# EAGLE design Power Board (EAGLE 9.1.3)
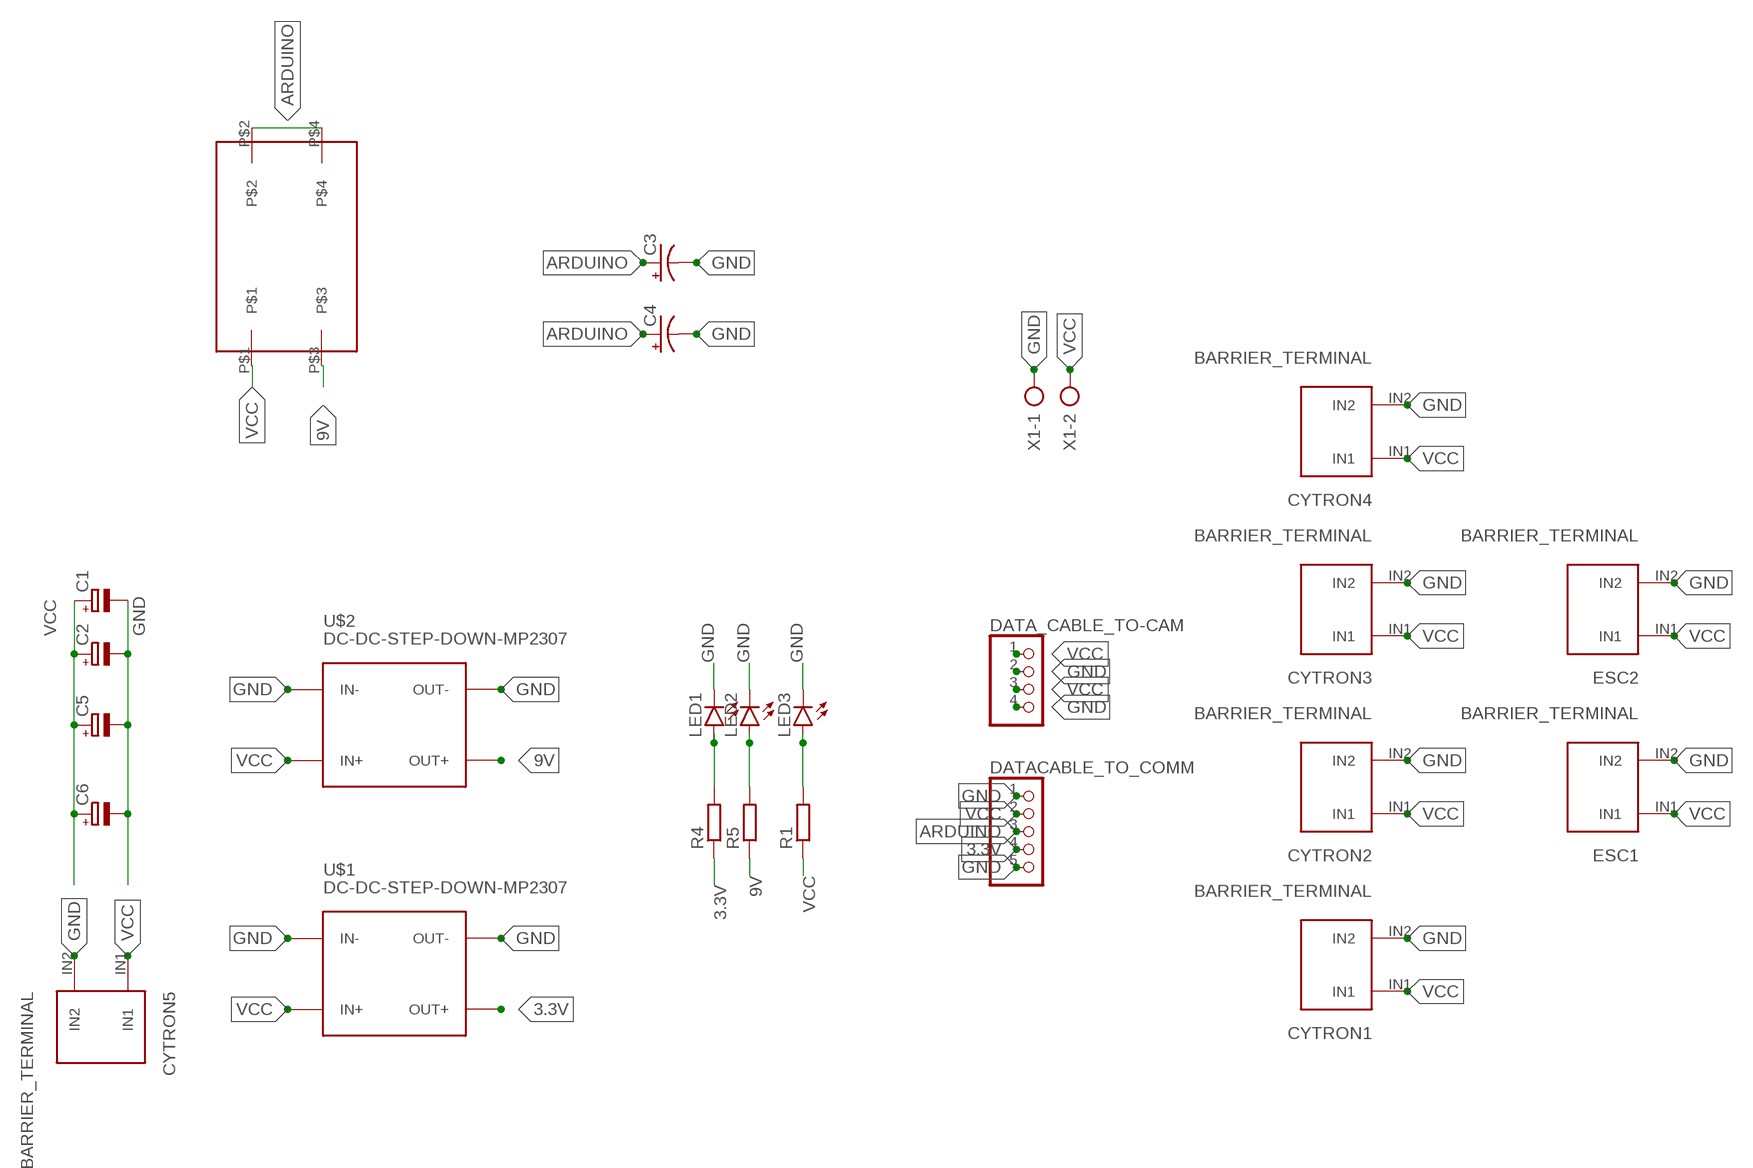
[diagram p0: schematic, sheet 1]

## Parts
C1  CPOL-EUE7.5-16  [E7,5-16]
C2  CPOL-EUE7.5-16  [E7,5-16]
C3  CPOL-USE5-13  [E5-13]
C4  CPOL-USE5-13  [E5-13]
C5  CPOL-EUE7.5-16  [E7,5-16]
C6  CPOL-EUE7.5-16  [E7,5-16]
CYTRON1  BARRIER_TERMINAL  [BARRIER_TERMINAL]
CYTRON2  BARRIER_TERMINAL  [BARRIER_TERMINAL]
CYTRON3  BARRIER_TERMINAL  [BARRIER_TERMINAL]
CYTRON4  BARRIER_TERMINAL  [BARRIER_TERMINAL]
CYTRON5  BARRIER_TERMINAL  [BARRIER_TERMINAL]
DATA_CABLE_TO-CAM  PINHD-1X4  [1X04]
DATACABLE_TO_COMM  PINHD-1X5  [1X05]
ESC1  BARRIER_TERMINAL  [BARRIER_TERMINAL]
ESC2  BARRIER_TERMINAL  [BARRIER_TERMINAL]
LED1  LED3MM  [LED3MM]
LED2  LED3MM  [LED3MM]
LED3  LED3MM  [LED3MM]
R1  R-EU_0204/7  [0204/7]
R4  R-EU_0204/7  [0204/7]
R5  R-EU_0204/7  [0204/7]
U$1  DC-DC-STEP-DOWN-MP2307  [DC-DC-STEP-DOWN-MP2307]
U$2  DC-DC-STEP-DOWN-MP2307  [DC-DC-STEP-DOWN-MP2307]
U$3  DIPSWITCH_2PINS  [DIPSWITCH_2PINS]
X1  AK300/2  [AK300/2]

## Nets
3.3V: DATACABLE_TO_COMM.4 R4.1 U$1.OUT+
9V: R5.1 U$2.OUT+ U$3.P$3
ARDUINO: C3.+ C4.+ DATACABLE_TO_COMM.3 U$3.P$2 U$3.P$4
GND: C1.- C2.- C3.- C4.- C5.- C6.- CYTRON1.IN2 CYTRON2.IN2 CYTRON3.IN2 CYTRON4.IN2 CYTRON5.IN2 DATA_CABLE_TO-CAM.2 DATA_CABLE_TO-CAM.4 DATACABLE_TO_COMM.1 DATACABLE_TO_COMM.5 ESC1.IN2 ESC2.IN2 LED1.K(C) LED2.K(C) LED3.K(C) U$1.IN- U$1.OUT- U$2.IN- U$2.OUT- X1.1
N$1: LED3.A R1.2
N$9: LED1.A R4.2
N$10: LED2.A R5.2
VCC: C1.+ C2.+ C5.+ C6.+ CYTRON1.IN1 CYTRON2.IN1 CYTRON3.IN1 CYTRON4.IN1 CYTRON5.IN1 DATA_CABLE_TO-CAM.1 DATA_CABLE_TO-CAM.3 DATACABLE_TO_COMM.2 ESC1.IN1 ESC2.IN1 R1.1 U$1.IN+ U$2.IN+ U$3.P$1 X1.2

## Library data of the parts
C1 C2 C5 C6 = rcl:CPOL-EU: POLARIZED CAPACITOR, European symbol; SPICEPREFIX: C
C3 C4 = rcl:CPOL-US: POLARIZED CAPACITOR, American symbol; SPICEPREFIX: C
CYTRON1-CYTRON5 ESC1 ESC2 = High power Rosetta:BARRIER_TERMINAL
DATA_CABLE_TO-CAM = pinhead:PINHD-1X4: PIN HEADER
DATACABLE_TO_COMM = pinhead:PINHD-1X5: PIN HEADER
LED1-LED3 = led:LED: LED OSRAM: - CHIPLED LG R971, LG N971, LY N971, LG Q971, LY Q971, LO R971, LY R971 LH N974, LH R974 LS Q976, LO Q976, LY Q976 LO Q996 - Hyper CHIPLED LW Q18S LB Q993, LB Q99A, LB R99A - SideLED LS A670, LO A670, LY A670, LG A670, LP A670 LB A673, LV A673, LT A673, LW A673 LH A674 LY A675 LS A676, LA A676, LO A676, LY A676, LW A676 LS A679, LY A679, LG A679 - Hyper Micro SIDELED® LS Y876, LA Y876, LO Y876, LY Y876 LT Y87S - SmartLED LW L88C, LW L88S LB L89C, LB L89S, LG L890 LS L89K, LO L89K, LY L89K LS L896, LA L896, LO L896, LY L896 - TOPLED LS T670, LO T670, LY T670, LG T670, LP T670 LSG T670, LSP T670, LSY T670, LOP T670, LYG T670 LG T671, LOG T671, LSG T671 LB T673, LV T673, LT T673, LW T673 LH T674 LS T676, LA T676, LO T676, LY T676, LB T676, LH T676, LSB T676, LW T676 LB T67C, LV T67C, LT T67C, LS T67K, LO T67K, LY T67K, LW E67C LS E67B, LA E67B, LO E67B, LY E67B, LB E67C, LV E67C, LT E67C LW T67C LS T679, LY T679, LG T679 LS T770, LO T770, LY T770, LG T770, LP T770 LB T773, LV T773, LT T773, LW T773 LH T774 LS E675, LA E675, LY E675, LS T675 LS T776, LA T776, LO T776, LY T776, LB T776 LHGB T686 LT T68C, LB T68C - Hyper Mini TOPLED® LB M676 - Mini TOPLED Santana® LG M470 LS M47K, LO M47K, LY M47K Source: http://www.osram.convergy.de LUXEON: - LUMILED® LXK2-PW12-R00, LXK2-PW12-S00, LXK2-PW14-U00, LXK2-PW14-V00 LXK2-PM12-R00, LXK2-PM12-S00, LXK2-PM14-U00 LXK2-PE12-Q00, LXK2-PE12-R00, LXK2-PE12-S00, LXK2-PE14-T00, LXK2-PE14-U00 LXK2-PB12-K00, LXK2-PB12-L00, LXK2-PB12-M00, LXK2-PB14-N00, LXK2-PB14-P00, LXK2-PB14-Q00 LXK2-PR12-L00, LXK2-PR12-M00, LXK2-PR14-Q00, LXK2-PR14-R00 LXK2-PD12-Q00, LXK2-PD12-R00, LXK2-PD12-S00 LXK2-PH12-R00, LXK2-PH12-S00 LXK2-PL12-P00, LXK2-PL12-Q00, LXK2-PL12-R00 Source: www.luxeon.com KINGBRIGHT: KA-3528ASYC Source: www.kingbright.com
R1 R4 R5 = rcl:R-EU_: RESISTOR, European symbol; SPICEPREFIX: R
U$1 U$2 = Buck_MINI:DC-DC-STEP-DOWN-MP2307: DC/DC Step-Down Regulator based on MP2307DN chip MP2307 datasheet available here: https://cdn-shop.adafruit.com/datasheets/MP2307_r1.9.pdf Click here to find device on ebay.com <http://www.ebay.com/sch/dc+dc+3a+mini+converter>
U$3 = dipswitch_2pins:DIPSWITCH_2PINS
X1 = con-ptr500:AK300/2: CONNECTOR; OC_FARNELL: unknown; OC_NEWARK: unknown

## Board
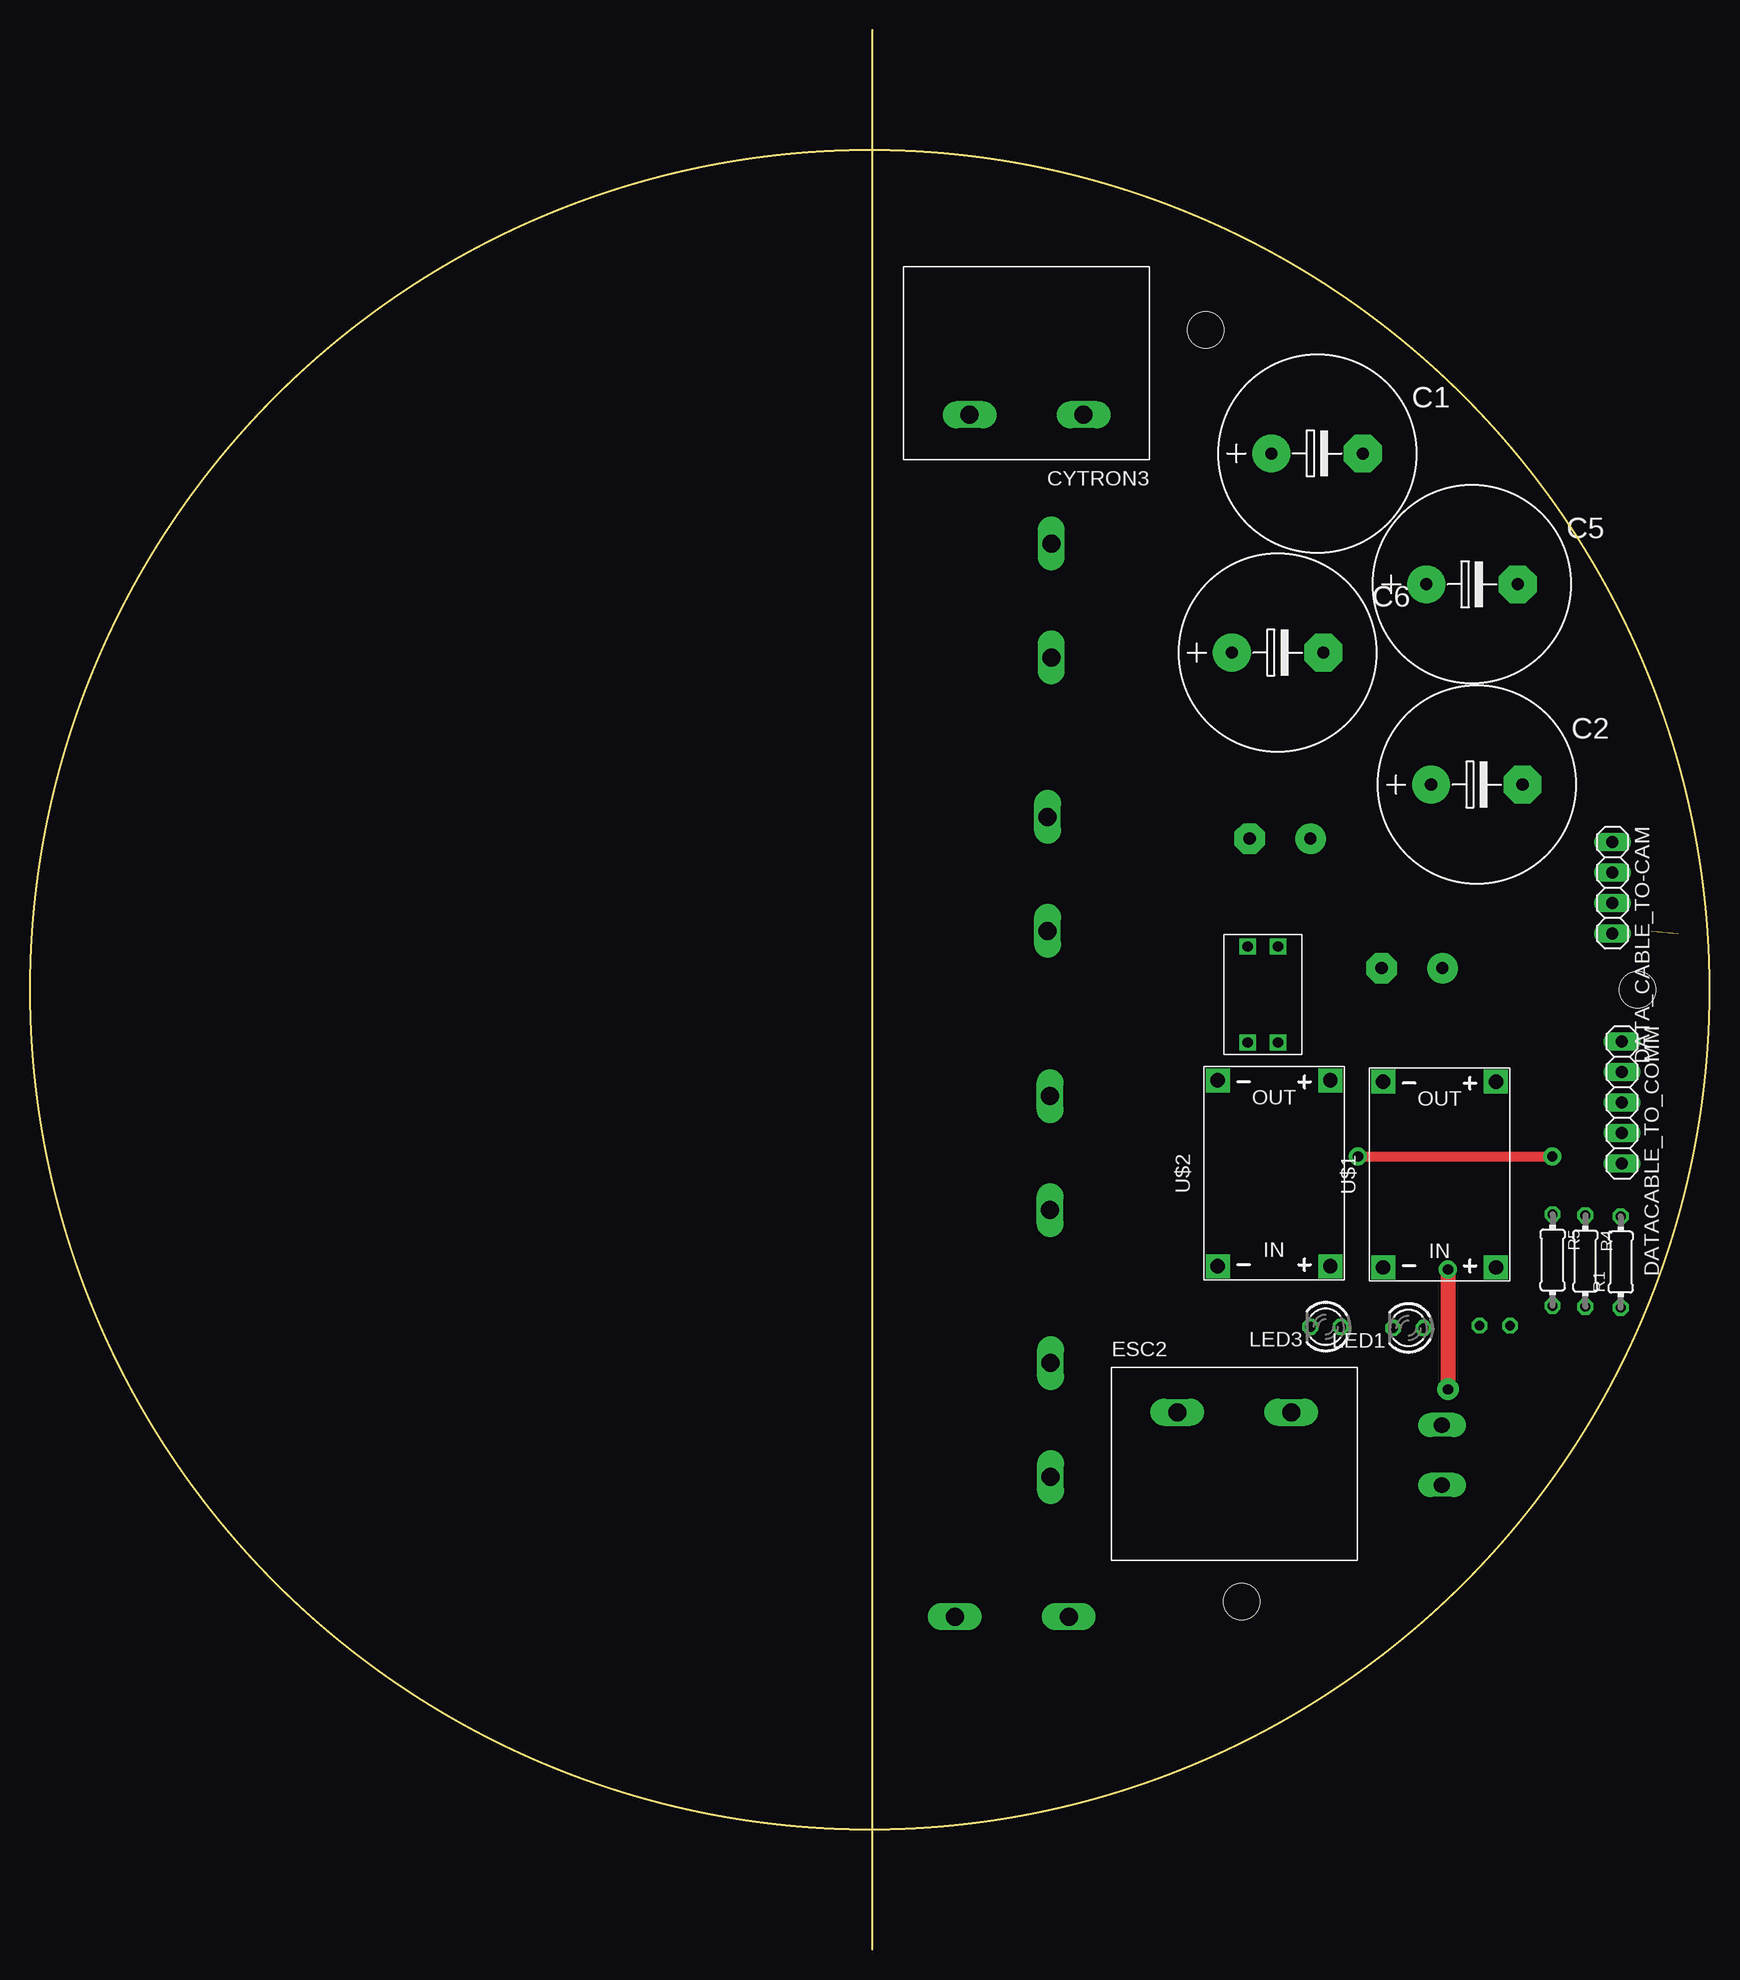
[diagram p1: board, top side]
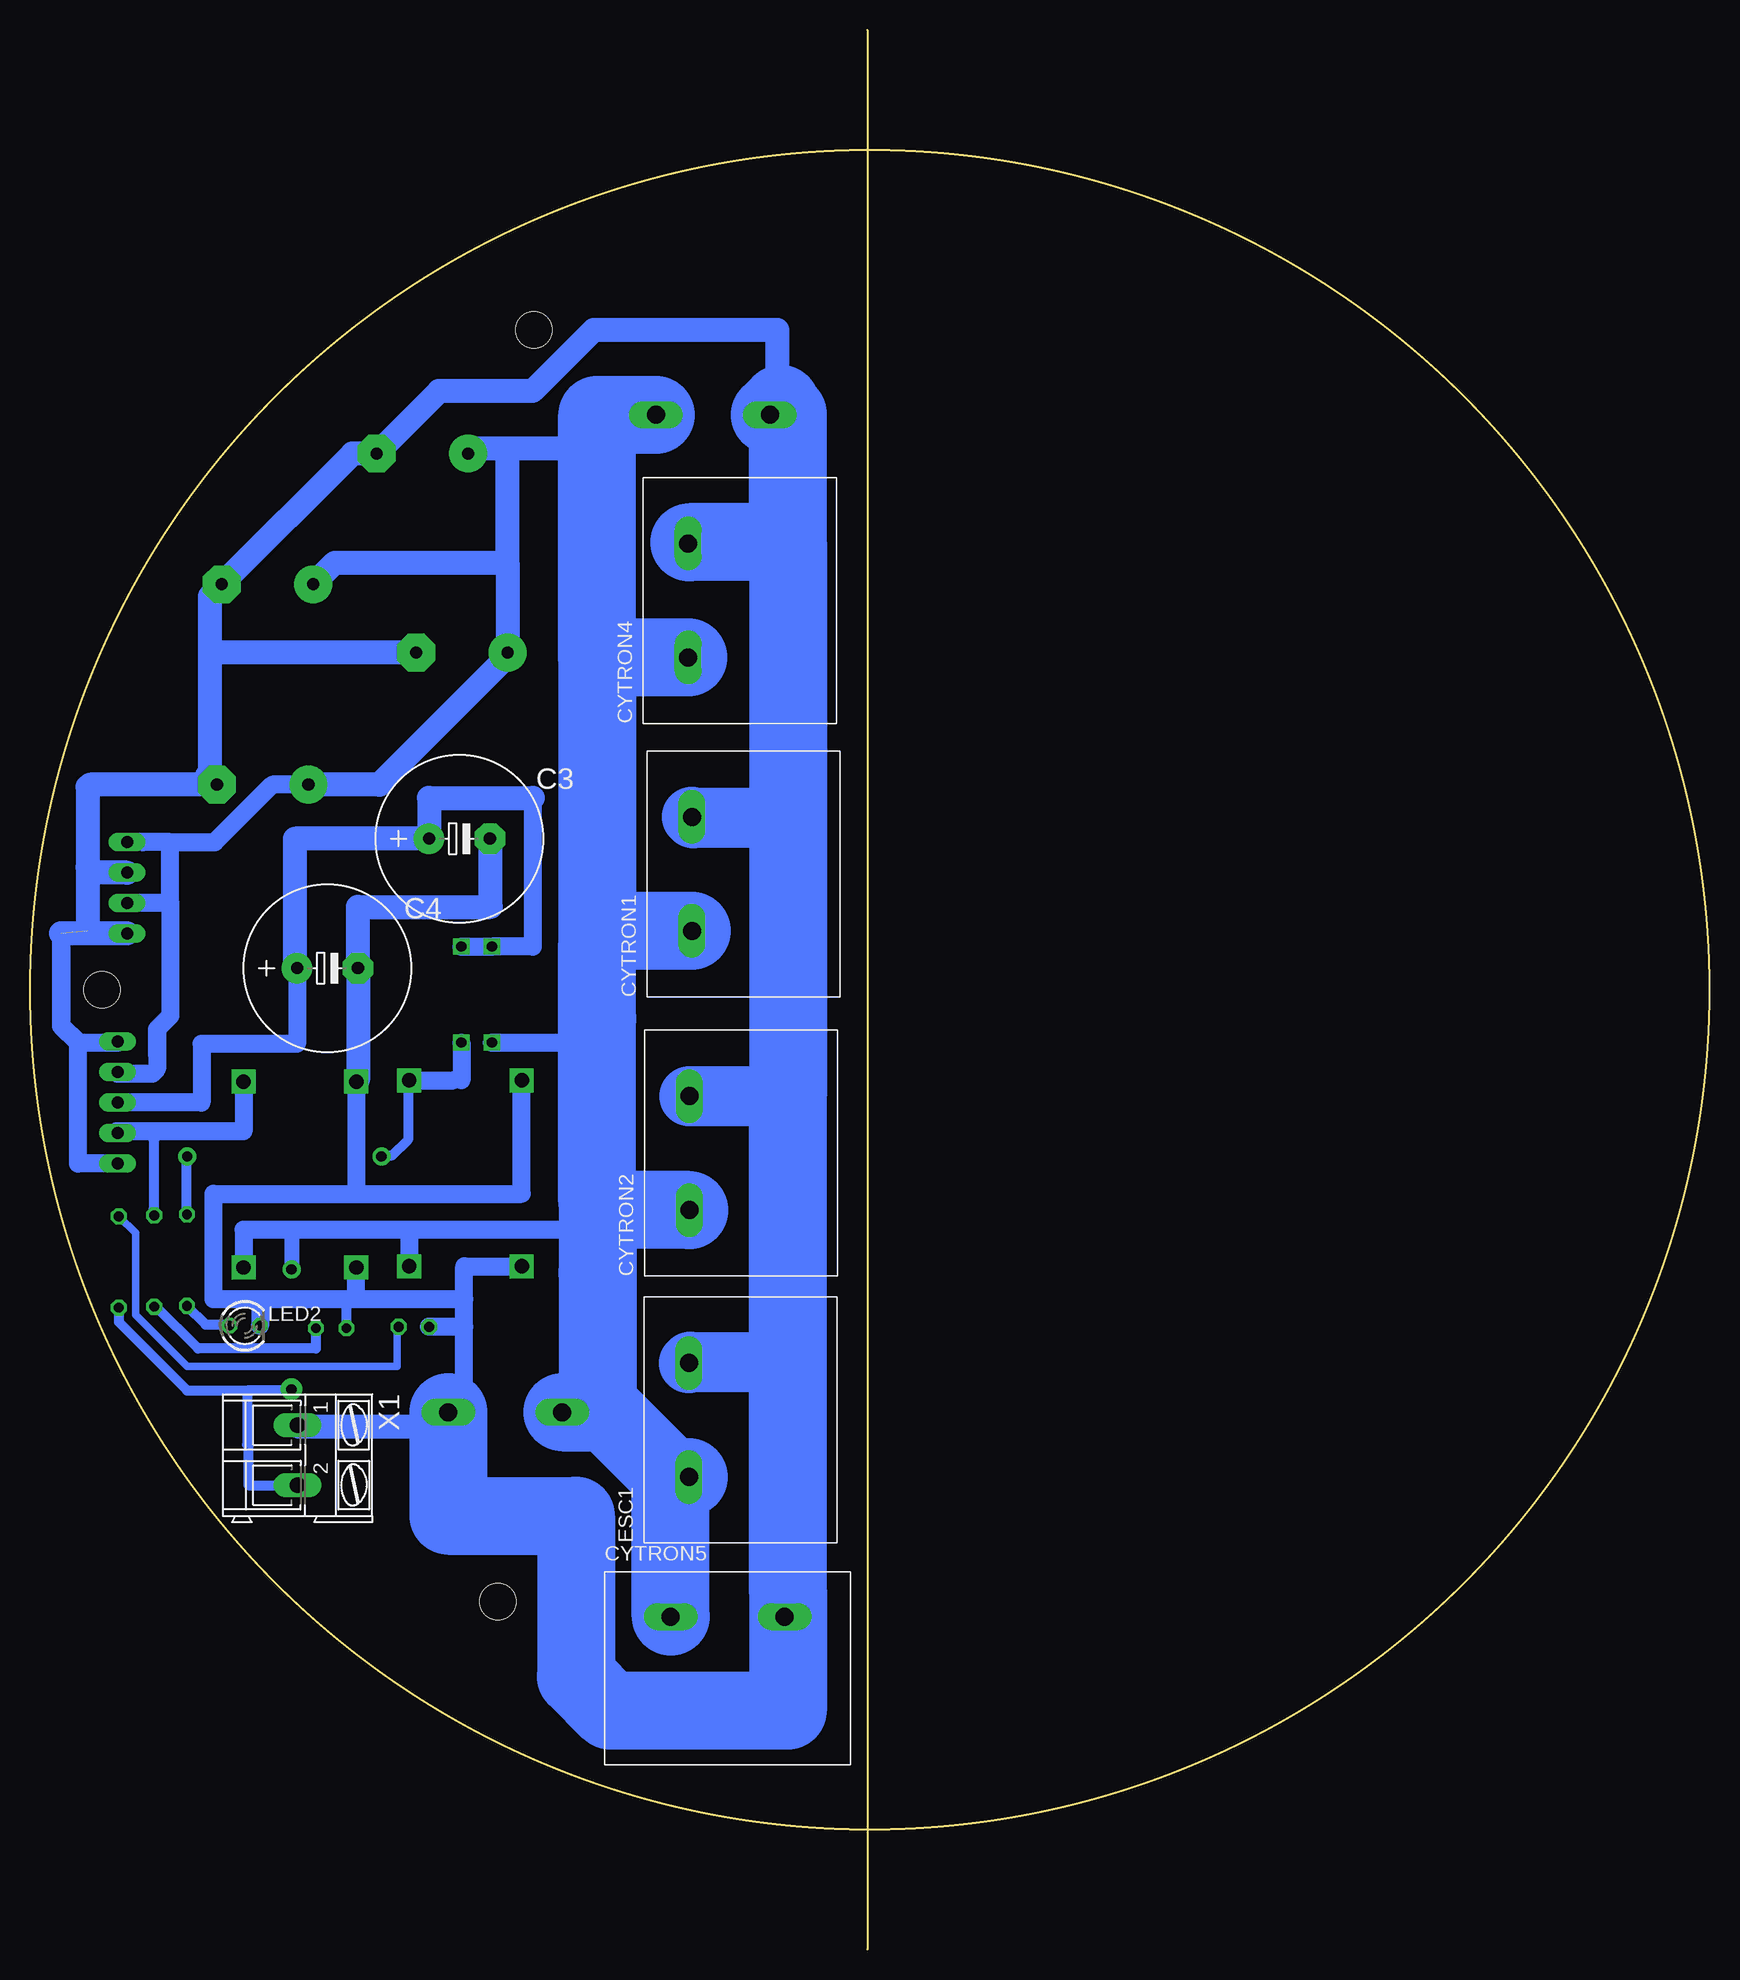
[diagram p2: board, bottom side, seen from below]

Size 140 x 160 mm. Coordinates in mm from the lower left corner, seen from the top.
Outline: 70.2,160 70.2,0
Outline: circle at 70,80 radius 70
Copper layers (1*16): Top 0.035mm / dielectric 1.5mm / Bottom 0.035mm
Design rules "default *": minimum track width 6mil, minimum drill 0.35mm, track to track 0.8mm, track to pad 0.8mm, pad to pad 0.8mm, via to via 0.8mm, smd to smd 6mil, copper to edge 40mil, drill to drill 6mil, minimum pad ring 10mil, minimum via ring 8mil, stop-mask expansion 4mil, vias tented up to drill 0mil, thermal gap 10mil
Holes 3 mm at 134,80 101,29 98,135

### Footprints (pad centres in the part's own frame; a part is rotated, then mirrored left to right if it is on the bottom)
E7,5-16 = drill 1.016 pad 3.15: + -3.81,0 | drill 1.016 pad 3.15 octagon: - 3.81,0
E5-13 = drill 1.016 pad 2.54: + -2.54,0 | drill 1.016 pad 2.54 octagon: - 2.54,0
BARRIER_TERMINAL = drill 1.5 long: IN1 5.5,12.35; IN2 15,12.35
1X04 = drill 1.016 long: 1 -3.81,0; 2 -1.27,0; 3 1.27,0; 4 3.81,0
1X05 = drill 1.016 long: 1 -5.08,0; 2 -2.54,0; 3 0,0; 4 2.54,0; 5 5.08,0
LED3MM = drill 0.813 octagon: A -1.27,0; K 1.27,0
0204/7 = drill 0.813 octagon: 1 -3.81,0; 2 3.81,0
DC-DC-STEP-DOWN-MP2307 = drill 1.2 pad 2 square: IN+ -7.747,-4.699; IN- -7.747,4.699; OUT+ 7.747,-4.699; OUT- 7.747,4.699
DIPSWITCH_2PINS = drill 0.85 square: P$1 2,1; P$2 2,9; P$3 4.54,1; P$4 4.54,9
AK300/2 = drill 1.321 long: 1 -2.515,0; 2 2.489,0

### Placement (x,y rotation side)
C1  107.3,124.7 0 top
C2  120.6,97.1 0 top
C3  104.2,92.6 0 bottom
C4  115.2,81.8 0 bottom
C5  120.2,113.8 0 top
C6  104,108.1 0 top
CYTRON1  72.48,79.4 90 bottom
CYTRON2  72.69,56.13 90 bottom
CYTRON3  93.32,140.28 180 top
CYTRON4  72.79,102.2 90 bottom
CYTRON5  92.1,15.4 0 bottom
DATA_CABLE_TO-CAM  131.91,88.5 270 top
DATACABLE_TO_COMM  132.7,70.6 270 top
ESC1  72.72,33.89 90 bottom
ESC2  90.14,32.43 0 top
LED1  114.9,51.8 180 top
LED2  122.1,52 0 bottom
LED3  108,51.9 180 top
R1  132.6,57.3 90 top
R4  129.65,57.38 270 top
R5  126.92,57.47 270 top
U$1  117.5,64.6 90 top
U$2  103.7,64.7 90 top
U$3  99.5,74.6 0 top
X1  117.7,41.2 270 bottom

### Tracks (layer width: path | path; a pad name or v marks a point on that pad's centre or on a via)
3.3V
  Bottom 0.813: 129.6,68.5 129.6,67.6 | 129.7,61.7 129.7,67.5 129.6,67.6 | 129.7,61.7 129.7,61.6 | 129.6,68.2 129.6,67.6 | 129.7,61.7 129.7,61.25 R4.1
  Bottom 1.016: DATACABLE_TO_COMM.4 132.7,68.2 131.3,68.2
  Bottom 1.5: U$1.OUT+ 122.2,68.2 126.9,68.2 | 126.9,68.2 129.1,68.2 131.3,68.2 132.8,68.2 | 126.9,68.2 129.6,68.2
9V  (via drill 0.35, 0.85 pad 1.5)
  Top 0.813: v126.8,66.1 v110.7,66.1 v110.6,66.2
  Bottom 0.813: U$2.OUT+ 108.5,72.45 108.5,67.5 109.8,66.2 v110.6,66.2 | v126.8,66.1 127,65.9 127,61.36 R5.1
  Bottom 1.27: 104.7,72.45 104.04,72.45
  Bottom 1.5: U$2.OUT+ 104.7,72.45 | U$3.P$3 104.04,72.45
ARDUINO
  Bottom 1.5: DATACABLE_TO_COMM.3 125.7,70.6 125.7,75.5 117.74,75.5 C4.+ | 98.1,96 98.1,83.6 U$3.P$2 U$3.P$4
  Bottom 2: 98.1,96 106.74,96 C3.+ 117.9,92.6 117.9,81.96 C4.+
GND  (1 unrouted)
  Bottom 0.813: 113.8,54.2 113.63,54.03 LED1.K
  Bottom 1.016: CYTRON5.IN2 76.83,27.75 76.83,30
  Bottom 1.5: 104.99,46.5 103.8,46.5 103.8,51.9 | U$2.IN- 103.8,56.95 103.8,54.2 | 103.8,51.9 103.8,54.2 | 103.8,51.9 LED3.K | 103.8,54.2 112.8,54.2 | 112.8,54.2 U$1.IN- | 120.83,54.2 113.8,54.2 112.8,54.2 | DATACABLE_TO_COMM.5 136,65.52 136,75.6 132.7,75.6 DATACABLE_TO_COMM.1 | 120.83,54.2 124.7,54.2 124.7,63 112.8,63 | U$2.OUT- 99,63 112.8,63 | U$1.OUT- 112.8,63 | 120.83,54.2 LED2.K
  Bottom 1.552: 137.4,84.69 137.4,77 136,75.6
  Bottom 2: 104.33,46.5 104.99,46.5 104.99,44.78 ESC2.IN2 106.34,43.58 117.57,43.58 X1.1 | 135.2,90.2 135.2,96.9 135,97.1 C2.- | DATA_CABLE_TO-CAM.4 137.4,84.69 | C3.- 101.6,92.6 101.6,86.9 112.66,86.9 C4.- 112.66,72.49 U$1.OUT- | 125.01,108 125.01,112.8 C5.- 113.11,124.7 C1.- 105.91,129.9 98.11,129.9 93.01,135 77.7,135 77.7,128.87 76.83,128 | 125.01,108 125.01,97.7 | C6.- 124.91,108.1 125.01,108 | DATA_CABLE_TO-CAM.2 134.77,89.77 135.2,90.2 | 135.2,90.2 135.2,84.9
  Bottom 2.54: 124.62,97.31 C2.- 125.01,97.7
  Bottom 5: CYTRON4.IN2 85.04,117.3 | 76.83,94.3 84.73,94.3 CYTRON1.IN2 | CYTRON2.IN2 76.83,71.13 | 76.83,49 84.97,49 ESC1.IN2 | 76.83,128 78.25,128 CYTRON3.IN2
  Bottom 6.5: 76.83,117.3 85.04,117.3 | 76.83,117.3 76.83,94.3 76.83,71.13 76.83,49 76.83,30 76.83,19.9 91.64,19.9 94.5,22.76 94.5,36.16 105.14,36.16 ESC2.IN2 | 76.83,117.3 76.83,128 | 77.4,128.85 CYTRON3.IN2
N$1
  Bottom 0.61: R1.2 131.2,59.71 131.2,52.9 126.9,48.6 109.4,48.6 109.4,51.77
  Bottom 0.813: 109.4,51.77 LED3.A
N$2  (via drill 0.85 pad 1.5)
  other vias: 126.9,66.1
N$9
  Bottom 0.813: R4.2 129.47,53.57 126,50.1 116.17,50.1 LED1.A
N$10
  Bottom 0.813: R5.2 125.36,52.1 123.92,52.1 123.47,52.1 LED2.A
VCC  (via drill 0.35, 0.85 pad 1.5, 0.85 pad 1.8)
  Top 1.27: v118.2,46.6 v118.2,46.7 118.2,56.6 v118.3,56.7
  Bottom 0.813: R1.1 132.6,52.3 126.9,46.6 121.9,46.6 | 121.9,46.6 121.9,42.1 121.8,42 121.8,38.7 X1.2 | v118.2,46.6 121.9,46.6
  Bottom 1.27: 118.2,60 v118.2,56.7 v118.3,56.7
  Bottom 1.5: 130.6,92.31 DATA_CABLE_TO-CAM.1 131.9,92.3 128.3,92.3 | 92.72,62.3 92.72,60 108.4,60 | 108.4,60 U$2.IN+ | 108.4,60 118.2,60 122.2,60 U$1.IN+ | DATACABLE_TO_COMM.2 132.7,73 129.8,73 129.4,73.4 129.4,74.59 129.4,76.72 129.38,76.74 | U$3.P$1 93.9,75.6 93.9,77.6 92.72,77.6 | 128.3,87.23 DATA_CABLE_TO-CAM.3 | 128.3,87.23 128.3,77.82 129.38,76.74 | 129.38,76.74 129.38,74.62 | C2.+ 119.8,97.1 124.6,92.3 128.3,92.3 | 128.3,87.23 128.3,92.3
  Bottom 2: 93.99,56.59 93.8,56.4 92.7,56.4 | X1.2 | C2.+ 110.89,97.1 100.19,107.8 C6.+ 100.19,115.6 | 92.72,125.1 100.2,125.1 | 100.2,125.1 103.09,125.1 C1.+ | 100.19,115.6 100.19,125.09 100.2,125.1 | C5.+ 114.59,115.6 100.19,115.6
  Bottom 2.54: 92.42,107.7 93.51,108.8
  Bottom 5: 92.42,107.7 92.72,107.4 | 91.72,84.9 92.72,83.9 | 92.72,62.3 92.7,62.3 92.03,61.63
  Bottom 6.5: CYTRON1.IN1 91.72,84.9 | CYTRON4.IN1 92.42,107.7 | ESC2.IN1 92.88,44.78 | CYTRON3.IN1 92.72,127.93 92.72,125.1 92.72,107.4 92.72,83.9 92.72,77.6 92.72,62.3 | 92.7,62.3 92.7,56.4 92.7,44.78 ESC2.IN1 | CYTRON2.IN1 92.03,61.63 | CYTRON5.IN1 86.6,39.39 | 86.6,39.39 91.99,44.78 ESC2.IN1 | 86.6,39.39 ESC1.IN1

### Text on the board
BD-Top: vcc | gnd | gnd | vcc | gnd | vcc | vcc | gnd | vcc | gnd | gnd | vcc | gnd | gnd | 12v | 9v | gnd | vcc | 9v | 3.3v | gnd | 12V | 3.3v | 9v | gnd | vcc